# Altium schematic sheet 2016核心板 v3.0.SchDoc
size A2
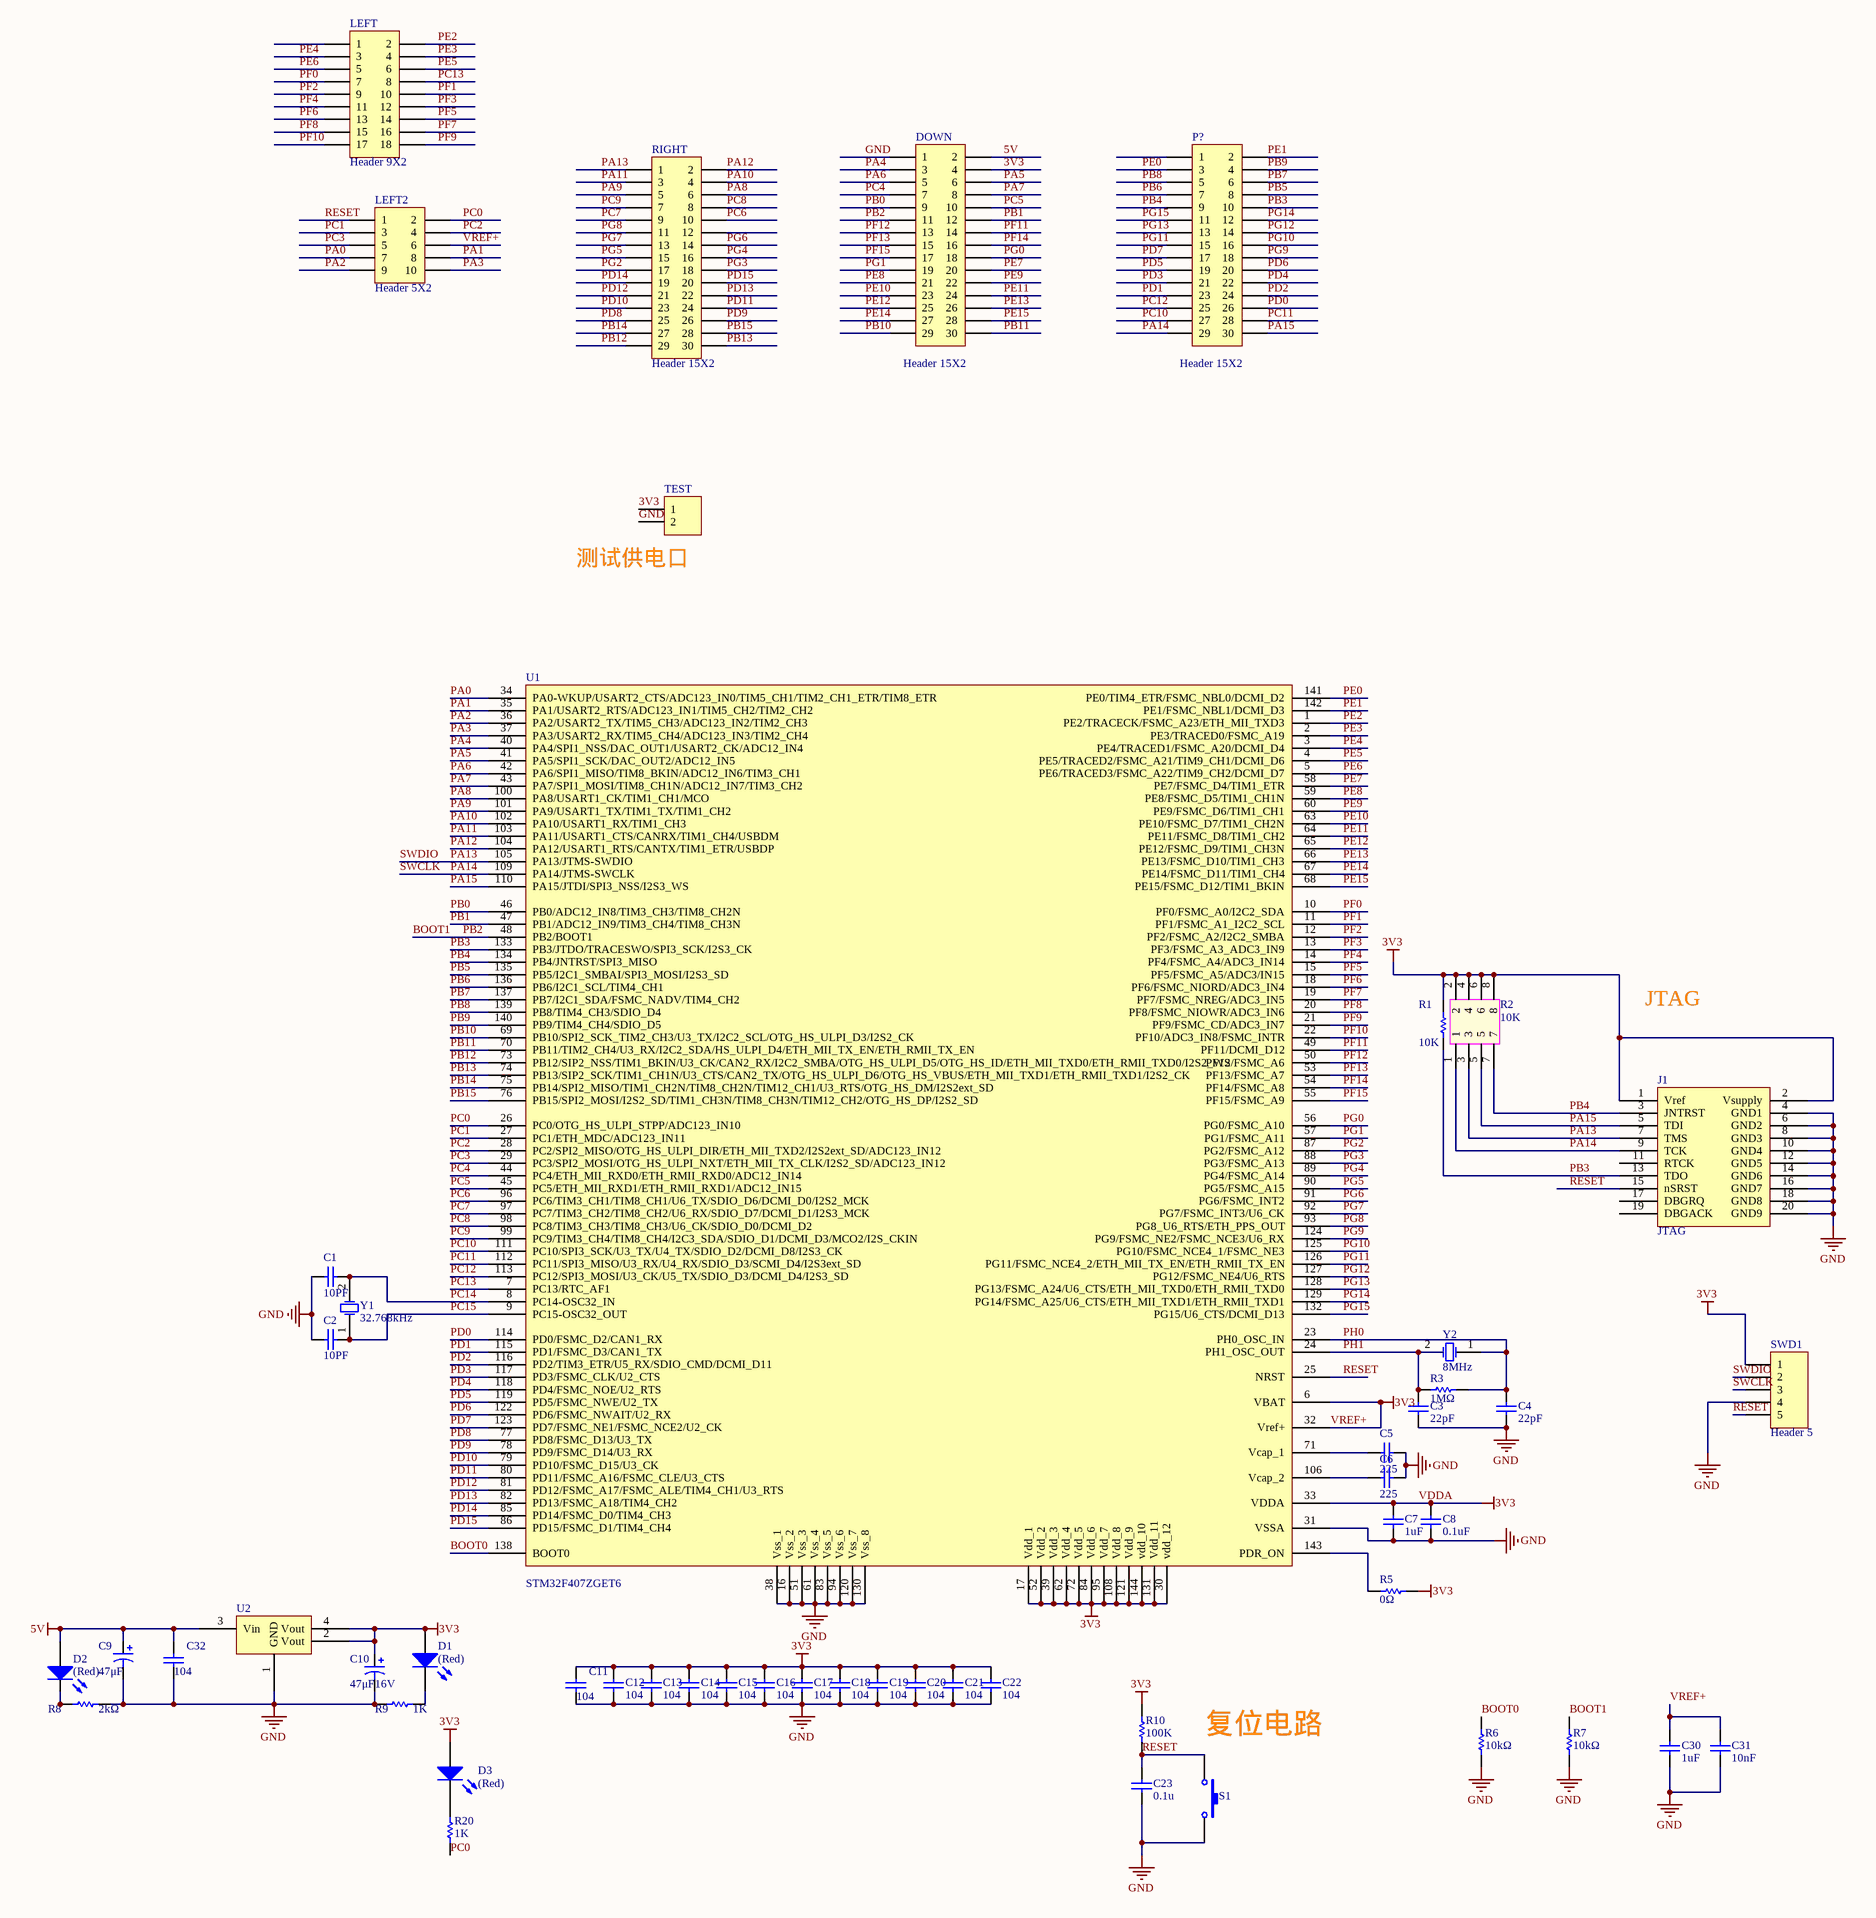
[diagram p0: 2016核心板 v3.0.SchDoc]

## Parts
C1  value 10PF  [CAP-MLCC-0603]  (hidden comment: CAP)
C2  value 10PF  [CAP-MLCC-0603]  (hidden comment: CAP)
C3  value 22pF  [CAP-MLCC-0603]  (hidden comment: CAP)
C4  value 22pF  [CAP-MLCC-0603]  (hidden comment: CAP)
C5  225  [CAP-MLCC-0603]
C6  225  [CAP-MLCC-0603]
C7  1uF  [CAP-MLCC-0603]
C8  0.1uF  [CAP-MLCC-0603]
C9  value 47μF  [CAP-TAN-6032/CAPC]  (hidden comment: CAP-TAN)
C10  value 47μF  [CAP-TAN-6032/CAPC]  (hidden comment: CAP-TAN)
C11  value 104  [CAP-MLCC-0603]  (hidden comment: CAP)
C12  value 104  [CAP-MLCC-0603]  (hidden comment: CAP)
C13  value 104  [CAP-MLCC-0603]  (hidden comment: CAP)
C14  value 104  [CAP-MLCC-0603]  (hidden comment: CAP)
C15  value 104  [CAP-MLCC-0603]  (hidden comment: CAP)
C16  value 104  [CAP-MLCC-0603]  (hidden comment: CAP)
C17  value 104  [CAP-MLCC-0603]  (hidden comment: CAP)
C18  value 104  [CAP-MLCC-0603]  (hidden comment: CAP)
C19  value 104  [CAP-MLCC-0603]  (hidden comment: CAP)
C20  value 104  [CAP-MLCC-0603]  (hidden comment: CAP)
C21  value 104  [CAP-MLCC-0603]  (hidden comment: CAP)
C22  value 104  [CAP-MLCC-0603]  (hidden comment: CAP)
C23  0.1u  [CAP-MLCC-0603]
C30  1uF  [CAP-MLCC-0603]
C31  10nF  [CAP-MLCC-0603]
C32  value 104  [CAP-MLCC-0603]  (hidden comment: CAP)
D1  value (Red)  [LED-1206]  (hidden comment: LED)
D2  value (Red)  [LED-1206]  (hidden comment: LED)
D3  value (Red)  [LED-1206]  (hidden comment: LED)
DOWN  Header 15X2  [HDR2X15]
J1  JTAG  [FC_2x10]
LEFT  Header 9X2  [HDR2X9]
LEFT2  Header 5X2  [HDR2X5]
P?  Header 15X2  [HDR2X15]
R1  10K  [Res-0603]
R2  10K  [RES-ARR4]
R3  1MΩ  [RES-0603]
R5  0Ω  [RES-0603]
R6  value 10kΩ  [RES-0603]  (hidden comment: RES)
R7  value 10kΩ  [RES-0603]  (hidden comment: RES)
R8  value 2kΩ  [RES-0603]  (hidden comment: RES)
R9  value 1K  [RES-0603]  (hidden comment: RES)
R10  value 100K  [RES-0603]  (hidden comment: RES)
R20  value 1K  [RES-0603]  (hidden comment: RES)
RIGHT  Header 15X2  [HDR2X15]
S1  SW-PB  [KEY]  (value not drawn)
SWD1  Header 5  [HDR1X5]
TEST  Header 2  [SIP2]  (value not drawn)
U1  STM32F407ZGET6  [LQFP144-L]
U2  IC-AS1117-3.3V  [SOT-223]  (value not drawn)
Y1  32.768kHz  [Osc-3216]
Y2  8MHz  [Osc-6032]

## Nets
3V3: C7.2 C8.2 C10.1 C11.2 C12.2 C13.2 C14.2 C15.2 C16.2 C17.2 C18.2 C19.2 C20.2 C21.2 C22.2 C30.2 C31.2 D1.1(A) D3.1(A) DOWN.4 J1.1(Vref) J1.2(Vsupply) LEFT2.6 R1.2 R2.2 R2.4 R2.6 R2.8 R5.2 R10.2 SWD1.1 TEST.1 U1.6(VBAT) U1.17(Vdd_1) U1.30(vdd_12) U1.32(Vref+) U1.33(VDDA) U1.39(Vdd_3) U1.52(Vdd_2) U1.62(Vdd_4) U1.72(Vdd_5) U1.84(Vdd_6) U1.95(Vdd_7) U1.108(Vdd_8) U1.121(Vdd_9) U1.131(Vdd_11) U1.144(vdd_10) U2.2(Vout) U2.4(Vout)  [also labelled VDDA, VREF+]
5V: C9.1 C32.2 D2.1(A) DOWN.2 U2.3(Vin)
GND: C1.1 C2.1 C3.1 C4.1 C5.2 C6.2 C7.1 C8.1 C9.2 C10.2 C11.1 C12.1 C13.1 C14.1 C15.1 C16.1 C17.1 C18.1 C19.1 C20.1 C21.1 C22.1 C23.1 C30.1 C31.1 C32.1 DOWN.1 J1.4(GND1) J1.6(GND2) J1.8(GND3) J1.10(GND4) J1.12(GND5) J1.14(GND6) J1.16(GND7) J1.18(GND8) J1.20(GND9) R6.1 R7.1 R8.2 R9.1 S1.2 SWD1.4 TEST.2 U1.16(Vss_2) U1.31(VSSA) U1.38(Vss_1) U1.51(Vss_3) U1.61(Vss_4) U1.83(Vss_5) U1.94(Vss_6) U1.120(Vss_7) U1.130(Vss_8) U2.1(GND)
BOOT0: R6.2 U1.138(BOOT0)
BOOT1: DOWN.11 R7.2 U1.48(PB2/BOOT1)  [also labelled PB2]
PA0: LEFT2.7 U1.34(PA0-WKUP/USART2_CTS/ADC123_IN0/TIM5_CH1/TIM2_CH1_ETR/TIM8_ETR)
PA1: LEFT2.8 U1.35(PA1/USART2_RTS/ADC123_IN1/TIM5_CH2/TIM2_CH2)
PA2: LEFT2.9 U1.36(PA2/USART2_TX/TIM5_CH3/ADC123_IN2/TIM2_CH3)
PA3: LEFT2.10 U1.37(PA3/USART2_RX/TIM5_CH4/ADC123_IN3/TIM2_CH4)
PA4: DOWN.3 U1.40(PA4/SPI1_NSS/DAC_OUT1/USART2_CK/ADC12_IN4)
PA5: DOWN.6 U1.41(PA5/SPI1_SCK/DAC_OUT2/ADC12_IN5)
PA6: DOWN.5 U1.42(PA6/SPI1_MISO/TIM8_BKIN/ADC12_IN6/TIM3_CH1)
PA7: DOWN.8 U1.43(PA7/SPI1_MOSI/TIM8_CH1N/ADC12_IN7/TIM3_CH2)
PA8: RIGHT.6 U1.100(PA8/USART1_CK/TIM1_CH1/MCO)
PA9: RIGHT.5 U1.101(PA9/USART1_TX/TIM1_TX/TIM1_CH2)
PA10: RIGHT.4 U1.102(PA10/USART1_RX/TIM1_CH3)
PA11: RIGHT.3 U1.103(PA11/USART1_CTS/CANRX/TIM1_CH4/USBDM)
PA12: RIGHT.2 U1.104(PA12/USART1_RTS/CANTX/TIM1_ETR/USBDP)
PA13: J1.7(TMS) R2.3 RIGHT.1 SWD1.2 U1.105(PA13/JTMS-SWDIO)  [also labelled SWDIO]
PA14: J1.9(TCK) P?.29 R2.1 SWD1.3 U1.109(PA14/JTMS-SWCLK)  [also labelled SWCLK]
PA15: J1.5(TDI) P?.30 R2.5 U1.110(PA15/JTDI/SPI3_NSS/I2S3_WS)
PB0: DOWN.9 U1.46(PB0/ADC12_IN8/TIM3_CH3/TIM8_CH2N)
PB1: DOWN.12 U1.47(PB1/ADC12_IN9/TIM3_CH4/TIM8_CH3N)
PB3: J1.13(TDO) P?.10 R1.1 U1.133(PB3/JTDO/TRACESWO/SPI3_SCK/I2S3_CK)
PB4: J1.3(JNTRST) P?.9 R2.7 U1.134(PB4/JNTRST/SPI3_MISO)
PB5: P?.8 U1.135(PB5/I2C1_SMBAI/SPI3_MOSI/I2S3_SD)
PB6: P?.7 U1.136(PB6/I2C1_SCL/TIM4_CH1)
PB7: P?.6 U1.137(PB7/I2C1_SDA/FSMC_NADV/TIM4_CH2)
PB8: P?.5 U1.139(PB8/TIM4_CH3/SDIO_D4)
PB9: P?.4 U1.140(PB9/TIM4_CH4/SDIO_D5)
PB10: DOWN.29 U1.69(PB10/SPI2_SCK_TIM2_CH3/U3_TX/I2C2_SCL/OTG_HS_ULPI_D3/I2S2_CK)
PB11: DOWN.30 U1.70(PB11/TIM2_CH4/U3_RX/I2C2_SDA/HS_ULPI_D4/ETH_MII_TX_EN/ETH_RMII_TX_EN)
PB12: RIGHT.29 U1.73(PB12/SIP2_NSS/TIM1_BKIN/U3_CK/CAN2_RX/I2C2_SMBA/OTG_HS_ULPI_D5/OTG_HS_ID/ETH_MII_TXD0/ETH_RMII_TXD0/I2S2_WS)
PB13: RIGHT.30 U1.74(PB13/SIP2_SCK/TIM1_CH1N/U3_CTS/CAN2_TX/OTG_HS_ULPI_D6/OTG_HS_VBUS/ETH_MII_TXD1/ETH_RMII_TXD1/I2S2_CK)
PB14: RIGHT.27 U1.75(PB14/SPI2_MISO/TIM1_CH2N/TIM8_CH2N/TIM12_CH1/U3_RTS/OTG_HS_DM/I2S2ext_SD)
PB15: RIGHT.28 U1.76(PB15/SPI2_MOSI/I2S2_SD/TIM1_CH3N/TIM8_CH3N/TIM12_CH2/OTG_HS_DP/I2S2_SD)
PC0: LEFT2.2 R20.1 U1.26(PC0/OTG_HS_ULPI_STPP/ADC123_IN10)
PC1: LEFT2.3 U1.27(PC1/ETH_MDC/ADC123_IN11)
PC2: LEFT2.4 U1.28(PC2/SPI2_MISO/OTG_HS_ULPI_DIR/ETH_MII_TXD2/I2S2ext_SD/ADC123_IN12)
PC3: LEFT2.5 U1.29(PC3/SPI2_MOSI/OTG_HS_ULPI_NXT/ETH_MII_TX_CLK/I2S2_SD/ADC123_IN12)
PC4: DOWN.7 U1.44(PC4/ETH_MII_RXD0/ETH_RMII_RXD0/ADC12_IN14)
PC5: DOWN.10 U1.45(PC5/ETH_MII_RXD1/ETH_RMII_RXD1/ADC12_IN15)
PC6: RIGHT.10 U1.96(PC6/TIM3_CH1/TIM8_CH1/U6_TX/SDIO_D6/DCMI_D0/I2S2_MCK)
PC7: RIGHT.9 U1.97(PC7/TIM3_CH2/TIM8_CH2/U6_RX/SDIO_D7/DCMI_D1/I2S3_MCK)
PC8: RIGHT.8 U1.98(PC8/TIM3_CH3/TIM8_CH3/U6_CK/SDIO_D0/DCMI_D2)
PC9: RIGHT.7 U1.99(PC9/TIM3_CH4/TIM8_CH4/I2C3_SDA/SDIO_D1/DCMI_D3/MCO2/I2S_CKIN)
PC10: P?.27 U1.111(PC10/SPI3_SCK/U3_TX/U4_TX/SDIO_D2/DCMI_D8/I2S3_CK)
PC11: P?.28 U1.112(PC11/SPI3_MISO/U3_RX/U4_RX/SDIO_D3/SCMI_D4/I2S3ext_SD)
PC12: P?.25 U1.113(PC12/SPI3_MOSI/U3_CK/U5_TX/SDIO_D3/DCMI_D4/I2S3_SD)
PC13: LEFT.8 U1.7(PC13/RTC_AF1)
PC14: C1.2 U1.8(PC14-OSC32_IN) Y1.2(OSC2)
PC15: C2.2 U1.9(PC15-OSC32_OUT) Y1.1(OSC1)
PD0: P?.26 U1.114(PD0/FSMC_D2/CAN1_RX)
PD1: P?.23 U1.115(PD1/FSMC_D3/CAN1_TX)
PD2: P?.24 U1.116(PD2/TIM3_ETR/U5_RX/SDIO_CMD/DCMI_D11)
PD3: P?.21 U1.117(PD3/FSMC_CLK/U2_CTS)
PD4: P?.22 U1.118(PD4/FSMC_NOE/U2_RTS)
PD5: P?.19 U1.119(PD5/FSMC_NWE/U2_TX)
PD6: P?.20 U1.122(PD6/FSMC_NWAIT/U2_RX)
PD7: P?.17 U1.123(PD7/FSMC_NE1/FSMC_NCE2/U2_CK)
PD8: RIGHT.25 U1.77(PD8/FSMC_D13/U3_TX)
PD9: RIGHT.26 U1.78(PD9/FSMC_D14/U3_RX)
PD10: RIGHT.23 U1.79(PD10/FSMC_D15/U3_CK)
PD11: RIGHT.24 U1.80(PD11/FSMC_A16/FSMC_CLE/U3_CTS)
PD12: RIGHT.21 U1.81(PD12/FSMC_A17/FSMC_ALE/TIM4_CH1/U3_RTS)
PD13: RIGHT.22 U1.82(PD13/FSMC_A18/TIM4_CH2)
PD14: RIGHT.19 U1.85(PD14/FSMC_D0/TIM4_CH3)
PD15: RIGHT.20 U1.86(PD15/FSMC_D1/TIM4_CH4)
PE0: P?.3 U1.141(PE0/TIM4_ETR/FSMC_NBL0/DCMI_D2)
PE1: P?.2 U1.142(PE1/FSMC_NBL1/DCMI_D3)
PE2: LEFT.2 U1.1(PE2/TRACECK/FSMC_A23/ETH_MII_TXD3)
PE3: LEFT.4 U1.2(PE3/TRACED0/FSMC_A19)
PE4: LEFT.3 U1.3(PE4/TRACED1/FSMC_A20/DCMI_D4)
PE5: LEFT.6 U1.4(PE5/TRACED2/FSMC_A21/TIM9_CH1/DCMI_D6)
PE6: LEFT.5 U1.5(PE6/TRACED3/FSMC_A22/TIM9_CH2/DCMI_D7)
PE7: DOWN.20 U1.58(PE7/FSMC_D4/TIM1_ETR)
PE8: DOWN.21 U1.59(PE8/FSMC_D5/TIM1_CH1N)
PE9: DOWN.22 U1.60(PE9/FSMC_D6/TIM1_CH1)
PE10: DOWN.23 U1.63(PE10/FSMC_D7/TIM1_CH2N)
PE11: DOWN.24 U1.64(PE11/FSMC_D8/TIM1_CH2)
PE12: DOWN.25 U1.65(PE12/FSMC_D9/TIM1_CH3N)
PE13: DOWN.26 U1.66(PE13/FSMC_D10/TIM1_CH3)
PE14: DOWN.27 U1.67(PE14/FSMC_D11/TIM1_CH4)
PE15: DOWN.28 U1.68(PE15/FSMC_D12/TIM1_BKIN)
PF0: LEFT.7 U1.10(PF0/FSMC_A0/I2C2_SDA)
PF1: LEFT.10 U1.11(PF1/FSMC_A1_I2C2_SCL)
PF2: LEFT.9 U1.12(PF2/FSMC_A2/I2C2_SMBA)
PF3: LEFT.12 U1.13(PF3/FSMC_A3_ADC3_IN9)
PF4: LEFT.11 U1.14(PF4/FSMC_A4/ADC3_IN14)
PF5: LEFT.14 U1.15(PF5/FSMC_A5/ADC3/IN15)
PF6: LEFT.13 U1.18(PF6/FSMC_NIORD/ADC3_IN4)
PF7: LEFT.16 U1.19(PF7/FSMC_NREG/ADC3_IN5)
PF8: LEFT.15 U1.20(PF8/FSMC_NIOWR/ADC3_IN6)
PF9: LEFT.18 U1.21(PF9/FSMC_CD/ADC3_IN7)
PF10: LEFT.17 U1.22(PF10/ADC3_IN8/FSMC_INTR)
PF11: DOWN.14 U1.49(PF11/DCMI_D12)
PF12: DOWN.13 U1.50(PF12/FSMC_A6)
PF13: DOWN.15 U1.53(PF13/FSMC_A7)
PF14: DOWN.16 U1.54(PF14/FSMC_A8)
PF15: DOWN.17 U1.55(PF15/FSMC_A9)
PG0: DOWN.18 U1.56(PG0/FSMC_A10)
PG1: DOWN.19 U1.57(PG1/FSMC_A11)
PG2: RIGHT.17 U1.87(PG2/FSMC_A12)
PG3: RIGHT.18 U1.88(PG3/FSMC_A13)
PG4: RIGHT.16 U1.89(PG4/FSMC_A14)
PG5: RIGHT.15 U1.90(PG5/FSMC_A15)
PG6: RIGHT.14 U1.91(PG6/FSMC_INT2)
PG7: RIGHT.13 U1.92(PG7/FSMC_INT3/U6_CK)
PG8: RIGHT.11 U1.93(PG8_U6_RTS/ETH_PPS_OUT)
PG9: P?.18 U1.124(PG9/FSMC_NE2/FSMC_NCE3/U6_RX)
PG10: P?.16 U1.125(PG10/FSMC_NCE4_1/FSMC_NE3)
PG11: P?.15 U1.126(PG11/FSMC_NCE4_2/ETH_MII_TX_EN/ETH_RMII_TX_EN)
PG12: P?.14 U1.127(PG12/FSMC_NE4/U6_RTS)
PG13: P?.13 U1.128(PG13/FSMC_A24/U6_CTS/ETH_MII_TXD0/ETH_RMII_TXD0)
PG14: P?.12 U1.129(PG14/FSMC_A25/U6_CTS/ETH_MII_TXD1/ETH_RMII_TXD1)
PG15: P?.11 U1.132(PG15/U6_CTS/DCMI_D13)
PH0: C4.2 R3.2 U1.23(PH0_OSC_IN) Y2.1(OSC1)
PH1: C3.2 R3.1 U1.24(PH1_OSC_OUT) Y2.2(OSC2)
RESET: C23.2 J1.15(nSRST) LEFT2.1 R10.1 S1.1 SWD1.5 U1.25(NRST)
NetC5_1: C5.1 U1.71(Vcap_1)
NetC6_1: C6.1 U1.106(Vcap_2)
NetD1_2: D1.2(K) R9.2
NetD2_2: D2.2(K) R8.1
NetD3_2: D3.2(K) R20.2
NetR5_1: R5.1 U1.143(PDR_ON)

Not connected (* = marked no-connect by the designer): J1 11(RTCK) 17(DBGRQ) 19(DBGACK); LEFT 1; P? 1; RIGHT 12

## Notes on the sheet
- (near TEST) 测试供电口
- JTAG
- (near C10) 16V
- (near S1) 复位电路

## Library data of the parts
C1-C4 C11-C22 C32 = CAP: 无极性电容; Published: 8-Jun-2000; LatestRevisionDate: 17-Jul-2002; LatestRevisionNote: Re-released for DXP Platform.; PackageReference: RAD-0.3; Publisher: Altium Limited; PackageDescription: Radial Cap, Thru-Hole; 2 Leads; 0.3 in Pin Spacing
C5-C8 C23 C30 C31 = CAP: 无极性电容; Value: *μF; Published: 8-Jun-2000; LatestRevisionDate: 17-Jul-2002; LatestRevisionNote: Re-released for DXP Platform.; PackageReference: RAD-0.3; Publisher: Altium Limited; PackageDescription: Radial Cap, Thru-Hole; 2 Leads; 0.3 in Pin Spacing
C9 C10 = CAP-TAN: 钽电容; Published: 8-Jun-2000; LatestRevisionDate: 17-Jul-2002; LatestRevisionNote: Re-released for DXP Platform.; PackageReference: POLAR0.8; Publisher: Altium Limited; PackageDescription: Polarized Capacitor; 2 Leads
DOWN P? RIGHT = Header 15X2: Header, 15-Pin, Dual row; LatestRevisionDate: 17-Jul-2002; LatestRevisionNote: Re-released for DXP Platform.; Publisher: Altium Limited
LEFT = Header 9X2: Header, 9-Pin, Dual row; LatestRevisionDate: 17-Jul-2002; LatestRevisionNote: Re-released for DXP Platform.; Publisher: Altium Limited
LEFT2 = Header 5X2: Header, 5-Pin, Dual row; LatestRevisionDate: 17-Jul-2002; LatestRevisionNote: Re-released for DXP Platform.; Publisher: Altium Limited
R1 = Res1: Resistor; Published: 8-Jun-2000; LatestRevisionDate: 17-Jul-2002; LatestRevisionNote: Re-released for DXP Platform.; PackageReference: AXIAL-0.3; Publisher: Altium Limited
R2 = RES-ARR4
R3 R5 = RES: 电阻; Value: *kΩ; Published: 8-Jun-2000; LatestRevisionDate: 17-Jul-2002; LatestRevisionNote: Re-released for DXP Platform.; PackageReference: AXIAL-0.3; Publisher: Altium Limited; PackageDescription: Axial Device, Thru-Hole; 2 Leads; 0.3 in Pin Spacing
R6-R10 R20 = RES: 电阻; Published: 8-Jun-2000; LatestRevisionDate: 17-Jul-2002; LatestRevisionNote: Re-released for DXP Platform.; PackageReference: AXIAL-0.3; Publisher: Altium Limited; PackageDescription: Axial Device, Thru-Hole; 2 Leads; 0.3 in Pin Spacing
S1 = SW-PB: Switch; Published: 24-Mar-1999; LatestRevisionDate: 17-Jul-2002; LatestRevisionNote: Re-released for DXP Platform.; PackageReference: SPST-2; Publisher: Altium Limited; PackageDescription: Switch; 2 Leads
SWD1 = Header 5: Header, 5-Pin; LatestRevisionDate: 17-Jul-2002; LatestRevisionNote: Re-released for DXP Platform.; Publisher: Altium Limited
TEST = Header 2: Header, 2-Pin; LatestRevisionDate: 17-Jul-2002; LatestRevisionNote: Re-released for DXP Platform.; Publisher: Altium Limited
U1 = Component_1
U2 = IC-AS1117-3.3V: AS1117-3.3V; pin to pad: 4>2
Y1 Y2 = C-Osc: Crystal Oscillator; Published: 8-Jun-2000; LatestRevisionDate: 17-Jul-2002; LatestRevisionNote: Re-released for DXP Platform.; PackageReference: R38; Publisher: Altium Limited; PackageDescription: Crystal, Thru-Hole; 2 Leads; Body 3.1 x 8.2 mm (Dia.xH)
D1-D3 = LED: Published: 8-Jun-2000; LatestRevisionDate: 08-Jul-2005; LatestRevisionNote: Mech Layer 1 removed.; PackageReference: LED-1; Publisher: Altium Limited; PackageDescription: LED; 2 Leads